# Altium schematic sheet uart_to_usb_debug.SchDoc
size 386 x 246 mm
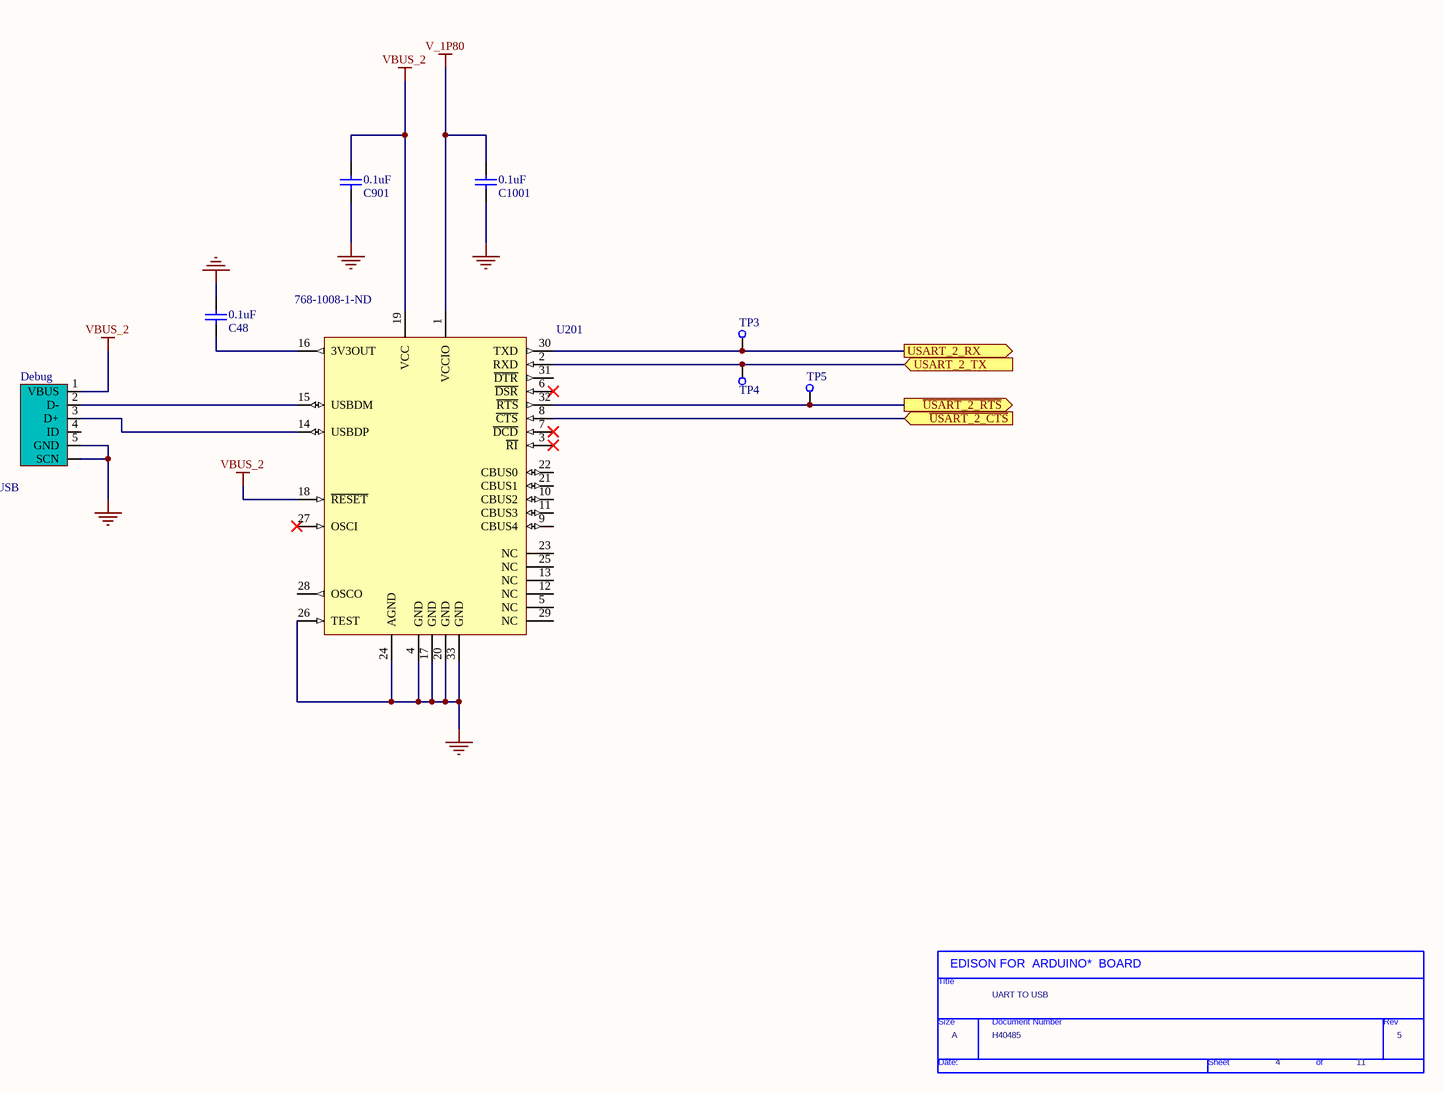
[diagram p0: uart_to_usb_debug.SchDoc]

## Parts
*  Page Count: 11  Page Number: 4  Page Size: A  Title: UART TO USB  RevCode: 5  Doc: H40485  (hidden comment: TitleBlock0)  (graphical)
C48  value 0.1uF  [CAPC0805(2012)145_L]  (hidden comment: CAP 100nF 16V 0805(2012))
C901  value 0.1uF  [CAPC0805(2012)145_L]  (hidden comment: CAP 100nF 16V 0805(2012))
C1001  value 0.1uF  [CAPC0805(2012)145_L]  (hidden comment: CAP 100nF 16V 0805(2012))
Debug  USB  [USB SMD]
TP3  TestPoint  [Testpoint]  (value not drawn)  (no BOM)
TP4  TestPoint  [Testpoint]  (value not drawn)  (no BOM)
TP5  Testpoint  [Testpoint]  (value not drawn)  (no BOM)
U201  Supplier Part Number 1: 768-1008-1-ND  [PQFN5X5-32_V]  (hidden comment: FT232RQ-Reel)

## Ports
USART_2_RX (out), USART_2_TX (in), ~{USART_2_CTS} (in), ~{USART_2_RTS} (out)

## Nets
GND: C48.1 C901.2 C1001.2 Debug.0(SCN) Debug.5(GND) U201.4(GND) U201.17(GND) U201.20(GND) U201.24(AGND) U201.26(TEST) U201.33(GND)
V_1P80: C1001.1 U201.1(VCCIO)
VBUS_2: C901.1 Debug.1(VBUS) U201.18(~{RESET}) U201.19(VCC)
~{USART_2_CTS}: U201.8(~{CTS}) ; port ~{USART_2_CTS}
~{USART_2_RTS}: TP5.1(TP) U201.32(~{RTS}) ; port ~{USART_2_RTS}
USART_2_RX: TP3.1(TP) U201.30(TXD) ; port USART_2_RX
USART_2_TX: TP4.1(TP) U201.2(RXD) ; port USART_2_TX
NetC48_2: C48.2 U201.16(3V3OUT)
NetDebug_2: Debug.2(D-) U201.15(USBDM)
NetDebug_3: Debug.3(D+) U201.14(USBDP)

Not connected (* = marked no-connect by the designer): Debug 4(ID); U201 3(~{RI})* 5(NC) 6(~{DSR})* 7(~{DCD})* 9(CBUS4) 10(CBUS2) 11(CBUS3) 12(NC) 13(NC) 21(CBUS1) 22(CBUS0) 23(NC) 25(NC) 27(OSCI)* 28(OSCO) 29(NC) 31(~{DTR})

## Notes on the sheet
- (in symbol TitleBlock0) EDISON FOR  ARDUINO*  BOARD; Title; Size; Document Number; Rev; Date:; Sheet; of

## Library data of the parts
C48 C901 C1001 = CMP-1036-04401-1: CAP 100nF 16V ±10% 0805 (2012 Metric) Thickness 1.45mm SMD; Case-Metric: 2012; Case-EIA: 0805; Max Thickness: 1.45 mm; Technology: SMT; Tolerance: ±10%; Rated Voltage: 16 V; Supplier 1: Digi-Key; Supplier Part Number 1: 311-1142-1-ND
Debug = USB_SMT_B: USB Type-B SMT Socket; Class: Connector; Supplier 1: Digi-Key; Supplier Part Number 1: 670-1190-1-ND
U201 = CMP-0078-00009-1: USB UART Asynchronous Serial Data Transfer Chip, QFN-32, Tape and Reel; PackageDescription: 32-Pin Quad Flat No-Lead 0.5 mm Pitch, Pullback, 3.2 x 3.2 mm Exposed Pad; DatasheetVersion: ver 2.07, Jul-2010; PackageVersion: 2010; PackageReference: PQFN5X5-32; Supplier 1: Digi-Key
* = TitleBlock0: Page Create Date: March  8, 1995